# EAGLE design tema (EAGLE 8.1.1)
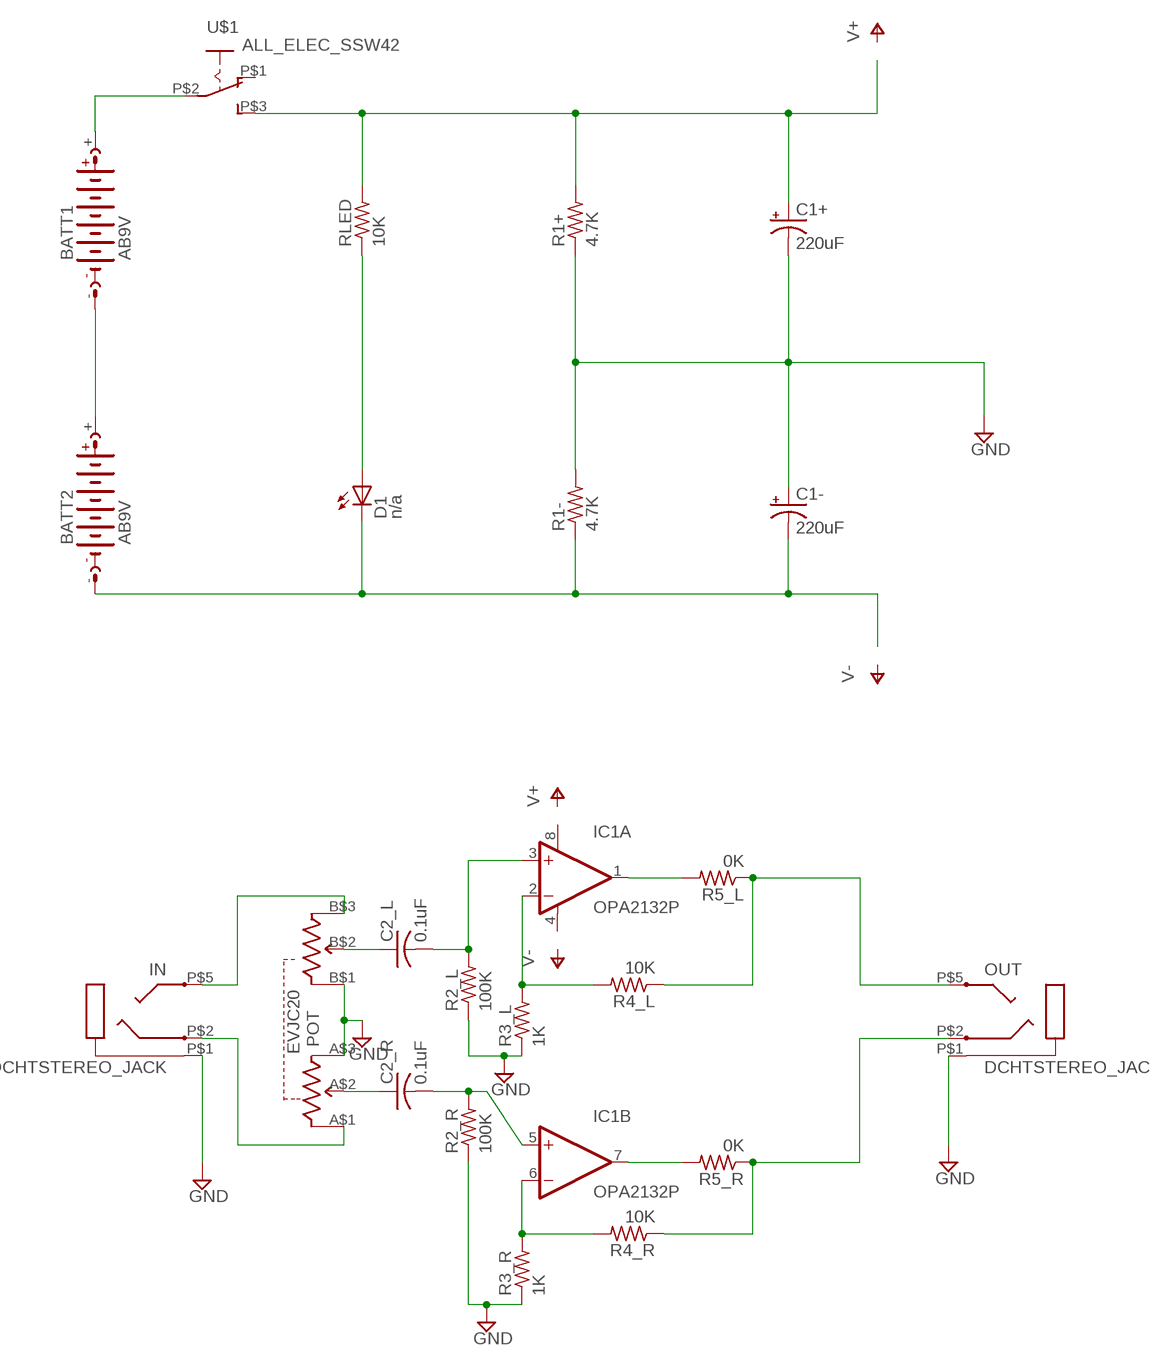
[diagram p0: schematic, sheet 1]

## Parts
BATT1  AB9V  [AB9V]
BATT2  AB9V  [AB9V]
C1+  220uF  CPOL-USE3.5-8  [E3,5-8]
C1-  220uF  CPOL-USE3.5-8  [E3,5-8]
C2_L  0.1uF  C-US075-052X106  [C075-052X106]
C2_R  0.1uF  C-US075-052X106  [C075-052X106]
D1  n/a  LED5MM  [LED5MM]
IC1  OPA2132P  [DIL08]
IN  DCHTSTEREO_JACK  [DCHTSTJACK]
OUT  DCHTSTEREO_JACK  [DCHTSTJACK]
POT  EVJC20  [PC16D]
R1+  4.7K  R-US_0207/5V  [0207/5V]
R1-  4.7K  R-US_0207/5V  [0207/5V]
R2_L  100K  R-US_0207/7  [0207/7]
R2_R  100K  R-US_0207/7  [0207/7]
R3_L  1K  R-US_0207/7  [0207/7]
R3_R  1K  R-US_0207/7  [0207/7]
R4_L  10K  R-US_0207/7  [0207/7]
R4_R  10K  R-US_0207/7  [0207/7]
R5_L  0K  R-US_0207/7  [0207/7]
R5_R  0K  R-US_0207/7  [0207/7]
RLED  10K  R-US_0207/5V  [0207/5V]
U$1  ALL_ELEC_SSW42  [SSW-42]

## Nets
GND: C1+.- C1-.+ IN.P$1 OUT.P$1 POT.A$3(1E) POT.B$1(2A) R1+.1 R1-.2 R2_L.1 R2_R.1 R3_L.1 R3_R.1
N$1: BATT1.- BATT2.+
N$2: BATT1.+ U$1.P$2(P)
N$3: C1+.+ R1+.2 RLED.2 U$1.P$3(S)
N$4: BATT2.- C1-.- D1.K(C) R1-.1
N$6: D1.A RLED.1
N$7: IN.P$2 POT.A$1(1A)
N$8: IN.P$5 POT.B$3(2E)
N$9: C2_R.1 POT.A$2(1S)
N$10: C2_L.1 POT.B$2(2S)
N$11: C2_L.2 IC1.3(A:+IN) R2_L.2
N$12: IC1.2(A:-IN) R3_L.2 R4_L.2
N$13: C2_R.2 IC1.5(B:+IN) R2_R.2
N$14: IC1.6(B:-IN) R3_R.2 R4_R.2
N$15: IC1.7(B:OUT) R5_R.2
N$16: IC1.1(A:OUT) R5_L.2
N$17: OUT.P$2 R4_R.1 R5_R.1
N$18: OUT.P$5 R4_L.1 R5_L.1
Unconnected: U$1.P$1(O)

## Power pins joined to a net without a drawn wire
V+: IC1.8(A:V+)
V-: IC1.4(A:V-)

## Library data of the parts
BATT1 BATT2 = battery:AB9V: 9-V BATTERY CLIP
C1+ C1- = rcl:CPOL-US: POLARIZED CAPACITOR, American symbol
C2_L C2_R = rcl:C-US: CAPACITOR, American symbol
D1 = led:LED: LED OSRAM: - CHIPLED LG R971, LG N971, LY N971, LG Q971, LY Q971, LO R971, LY R971 LH N974, LH R974 LS Q976, LO Q976, LY Q976 LO Q996 - Hyper CHIPLED LW Q18S LB Q993, LB Q99A, LB R99A - SideLED LS A670, LO A670, LY A670, LG A670, LP A670 LB A673, LV A673, LT A673, LW A673 LH A674 LY A675 LS A676, LA A676, LO A676, LY A676, LW A676 LS A679, LY A679, LG A679 - Hyper Micro SIDELED® LS Y876, LA Y876, LO Y876, LY Y876 LT Y87S - SmartLED LW L88C, LW L88S LB L89C, LB L89S, LG L890 LS L89K, LO L89K, LY L89K LS L896, LA L896, LO L896, LY L896 - TOPLED LS T670, LO T670, LY T670, LG T670, LP T670 LSG T670, LSP T670, LSY T670, LOP T670, LYG T670 LG T671, LOG T671, LSG T671 LB T673, LV T673, LT T673, LW T673 LH T674 LS T676, LA T676, LO T676, LY T676, LB T676, LH T676, LSB T676, LW T676 LB T67C, LV T67C, LT T67C, LS T67K, LO T67K, LY T67K, LW E67C LS E67B, LA E67B, LO E67B, LY E67B, LB E67C, LV E67C, LT E67C LW T67C LS T679, LY T679, LG T679 LS T770, LO T770, LY T770, LG T770, LP T770 LB T773, LV T773, LT T773, LW T773 LH T774 LS E675, LA E675, LY E675, LS T675 LS T776, LA T776, LO T776, LY T776, LB T776 LHGB T686 LT T68C, LB T68C - Hyper Mini TOPLED® LB M676 - Mini TOPLED Santana® LG M470 LS M47K, LO M47K, LY M47K Source: http://www.osram.convergy.de LUXEON: - LUMILED® LXK2-PW12-R00, LXK2-PW12-S00, LXK2-PW14-U00, LXK2-PW14-V00 LXK2-PM12-R00, LXK2-PM12-S00, LXK2-PM14-U00 LXK2-PE12-Q00, LXK2-PE12-R00, LXK2-PE12-S00, LXK2-PE14-T00, LXK2-PE14-U00 LXK2-PB12-K00, LXK2-PB12-L00, LXK2-PB12-M00, LXK2-PB14-N00, LXK2-PB14-P00, LXK2-PB14-Q00 LXK2-PR12-L00, LXK2-PR12-M00, LXK2-PR14-Q00, LXK2-PR14-R00 LXK2-PD12-Q00, LXK2-PD12-R00, LXK2-PD12-S00 LXK2-PH12-R00, LXK2-PH12-S00 LXK2-PL12-P00, LXK2-PL12-Q00, LXK2-PL12-R00 Source: www.luxeon.com KINGBRIGHT: KA-3528ASYC Source: www.kingbright.com
IC1 = burr-brown:OPA2132: High Speed FET-Input Operational Amplifiers< Product Folder:OPA2132; MPN: OPA2132P; OC_FARNELL: 1212432; OC_NEWARK: 47P7461
IN OUT = rhine-misc:DCHTSTEREO_JACK
POT = rhine-misc:EVJC20
R1+ R1- R2_L R2_R R3_L R3_R R4_L R4_R R5_L R5_R RLED = rcl:R-US_: RESISTOR, American symbol
U$1 = rhine-misc:ALL_ELEC_SSW42

## Board
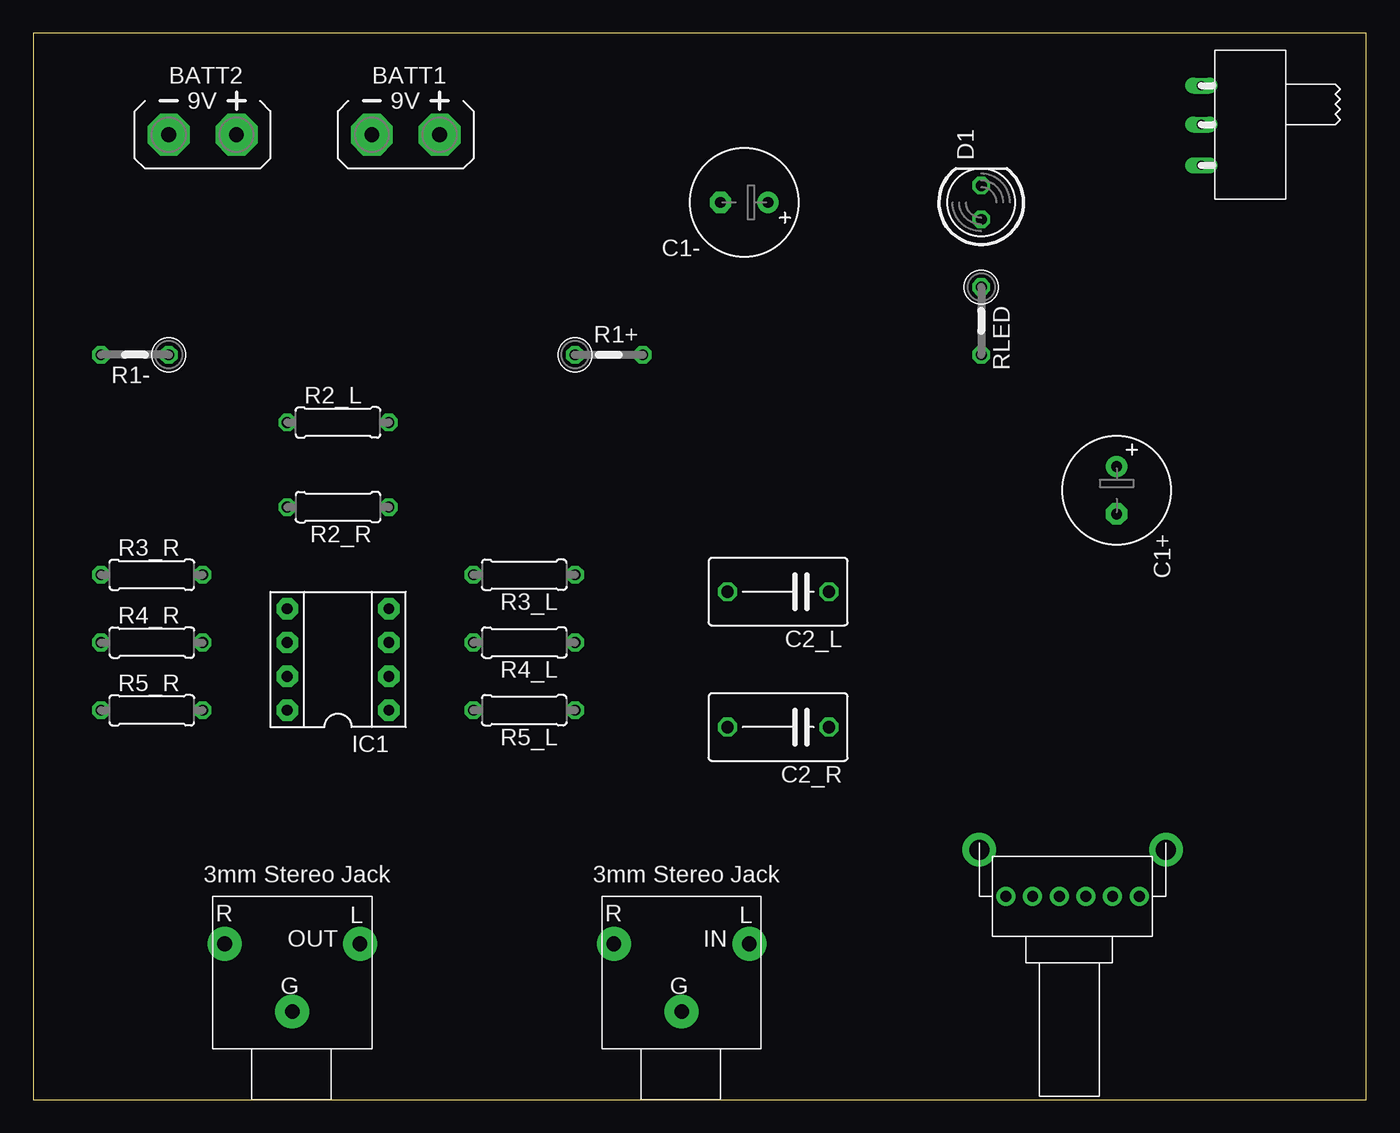
[diagram p1: board, top side]
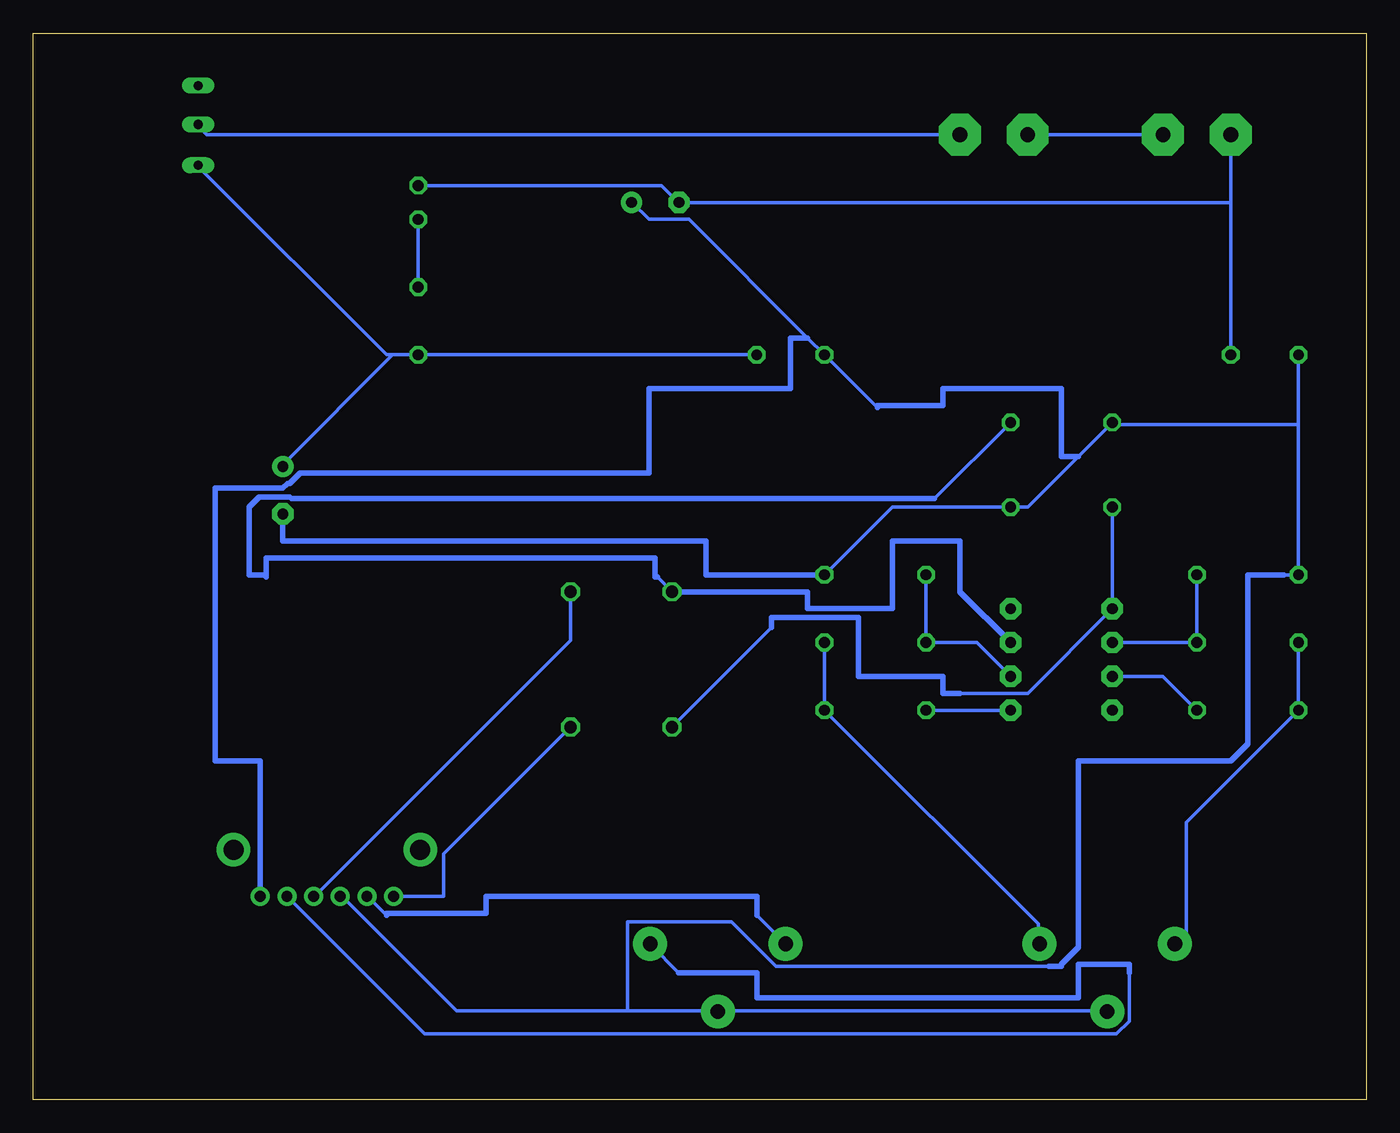
[diagram p2: board, bottom side, seen from below]

Size 100 x 80 mm. Coordinates in mm from the lower left corner, seen from the top.
Outline: 0,0 100,0 100,80 0,80 0,0
Copper layers (1*16): Top 0.035mm / dielectric 1.5mm / Bottom 0.035mm
Design rules "default *": minimum track width 10mil, minimum drill 24mil, track to track 10mil, track to pad 10mil, pad to pad 10mil, via to via 10mil, smd to smd 10mil, copper to edge 40mil, drill to drill 10mil, minimum pad ring 10mil, minimum via ring 8mil, stop-mask expansion 4mil, vias tented up to drill 0mil, thermal gap 10mil

### Footprints (pad centres in the part's own frame; a part is rotated, then mirrored left to right if it is on the bottom)
AB9V = drill 1.118 pad 3.15 octagon: + 0,2.54; - 0,-2.54
E3,5-8 = drill 0.813 pad 1.6: + -1.778,0 | drill 0.813 pad 1.6 octagon: - 1.778,0
C075-052X106 = drill 0.914 octagon: 1 -3.81,0; 2 3.81,0
LED5MM = drill 0.813 octagon: A -1.27,0; K 1.27,0
DIL08 = drill 0.813 pad 1.6 octagon: 1 -3.81,-3.81; 2 -1.27,-3.81; 3 1.27,-3.81; 4 3.81,-3.81; 5 3.81,3.81; 6 1.27,3.81; 7 -1.27,3.81; 8 -3.81,3.81
DCHTSTJACK = drill 1.1 pad 2.54: P$1 5.969,8.636; P$2 11.049,3.556; P$5 0.889,3.556
PC16D = drill 0.813 pad 1.422: A$1 -2.5,0; A$2 -4.5,0; A$3 5.5,0; B$1 -0.5,0; B$2 1.5,0; B$3 3.5,0 | drill 1.5 pad 2.54: A$4 -6.507,3.505; A$5 7.514,3.505
0207/5V = drill 0.813 octagon: 1 -2.54,0; 2 2.54,0
0207/7 = drill 0.813 octagon: 1 -3.81,0; 2 3.81,0
SSW-42 = drill 0.7 long: P$1 2.667,0; P$2 5.588,0; P$3 8.636,0

### Placement (x,y rotation side)
BATT1  27.94,72.39 270 top
BATT2  12.7,72.39 270 top
C1+  81.28,45.72 270 top
C1-  53.34,67.31 180 top
C2_L  55.88,38.1 180 top
C2_R  55.88,27.94 180 top
D1  71.12,67.31 90 top
IC1  22.86,33.02 90 top
IN  54.61,15.24 180 top
OUT  25.4,15.24 180 top
POT  77.47,15.24 0 top
R1+  43.18,55.88 0 top
R1-  7.62,55.88 180 top
R2_L  22.86,50.8 0 top
R2_R  22.86,44.45 180 top
R3_L  36.83,39.37 180 top
R3_R  8.89,39.37 0 top
R4_L  36.83,34.29 180 top
R4_R  8.89,34.29 0 top
R5_L  36.83,29.21 180 top
R5_R  8.89,29.21 0 top
RLED  71.12,58.42 270 top
U$1  87.63,78.74 270 top

### Tracks (layer width: path | path; a pad name or v marks a point on that pad's centre or on a via)
GND
  Bottom 0.254: C1-.+ 55.09,67.31 53.82,66.04 50.8,66.04 41.91,57.15 R1+.1 36.67,51.91 | POT.A$3 83.03,15.24 | 55.4,6.67 48.74,6.67 IN.P$1 48.58,6.67 19.53,6.67 OUT.P$1 | 55.4,6.67 68.26,6.67 76.83,15.24 POT.B$1 | R1-.2 5.08,50.64 | 5.08,50.64 R3_R.1 6.19,39.37 | C1+.- 81.28,43.81 | 40.48,39.69 R3_L.1 35.56,44.45 R2_R.1 25.4,44.45 21.59,48.26 R2_L.1 19.05,50.64 5.08,50.64 | 55.4,6.67 55.4,13.34 47.62,13.34 44.29,10 23.81,10
  Bottom 0.406: 23.81,10 22.86,10 22.86,10.16 21.59,11.43 21.59,25.4 10.16,25.4 8.89,26.67 8.89,39.37 6.19,39.37 | R3_L.1 49.53,39.37 49.53,41.91 81.28,41.91 C1+.- | 21.59,48.26 22.86,48.26 22.86,53.34 31.75,53.34 31.75,52.07 36.67,52.07 36.67,51.91 | 41.91,57.15 43.18,57.15 43.18,53.34 53.82,53.34 53.82,46.99 79.99,46.99 80.75,46.23 80.92,46.23 81.28,45.87 86.36,45.87 86.36,25.4 82.97,25.4 POT.A$3
N$1
  Bottom 0.254: BATT1.- BATT2.+
N$2
  Bottom 0.254: BATT1.+ 87,72.39 87.63,73.03 U$1.P$2
N$3
  Bottom 0.254: 73.03,55.88 RLED.2 R1+.2 | 73.03,55.88 73.5,55.88 87.63,70.01 U$1.P$3 | 73.03,55.88 81.28,47.62 C1+.+
N$4
  Bottom 0.254: D1.K 52.86,68.58 51.59,67.31 C1-.- 10.16,67.31 | BATT2.- 10.16,67.31 | 10.16,67.31 R1-.1
N$6
  Bottom 0.254: D1.A RLED.1
N$7
  Bottom 0.254: 73.5,13.81 74.93,15.24 POT.A$1 | 45.72,13.81 43.66,11.75 IN.P$2
  Bottom 0.406: 45.72,13.81 45.72,15.24 66.04,15.24 66.04,13.97 73.5,13.97 73.5,13.81
N$8
  Bottom 0.254: 17.78,9.53 17.78,5.87 18.73,4.92 70.64,4.92 POT.B$3 | 51.59,9.53 53.66,11.59 IN.P$5
  Bottom 0.406: 51.59,9.53 45.72,9.53 45.72,7.62 21.59,7.62 21.59,10.16 17.78,10.16 17.78,9.53
N$9
  Bottom 0.254: C2_R.1 69.22,18.41 69.22,15.24 POT.A$2
N$10
  Bottom 0.254: C2_L.1 59.69,34.45 78.9,15.24 POT.B$2
N$11
  Bottom 0.254: R2_L.2 32.38,45.09 | 53.18,39.21 C2_L.2 52.07,38.26
  Bottom 0.406: IC1.3 30.48,38.1 30.48,41.91 35.56,41.91 35.56,36.83 41.91,36.83 41.91,38.1 C2_L.2 | 53.18,39.21 53.34,39.21 53.34,40.64 82.55,40.64 82.55,39.21 82.55,39.37 83.82,39.37 83.82,44.45 83.06,45.21 80.75,45.21 80.63,45.09 32.38,45.09
N$12
  Bottom 0.254: R3_L.2 R4_L.2 29.21,34.29 IC1.2
N$13
  Bottom 0.254: R2_R.2 IC1.5 25.4,30.48 30.48,30.48 30.64,30.48 | 44.61,35.4 C2_R.2
  Bottom 0.406: 30.48,30.48 31.75,30.48 31.75,31.75 38.1,31.75 38.1,36.17 44.61,36.17 44.61,35.4
N$14
  Bottom 0.254: R3_R.2 R4_R.2 IC1.6
N$15
  Bottom 0.254: R5_R.2 15.24,31.75 IC1.7
N$16
  Bottom 0.254: IC1.1 R5_L.2
N$17
  Bottom 0.254: R4_R.1 R5_R.1 13.49,20.8 13.49,11.75 14.29,11.75 OUT.P$2
N$18
  Bottom 0.254: R4_L.1 R5_L.1 24.61,13.18 24.61,11.75 OUT.P$5